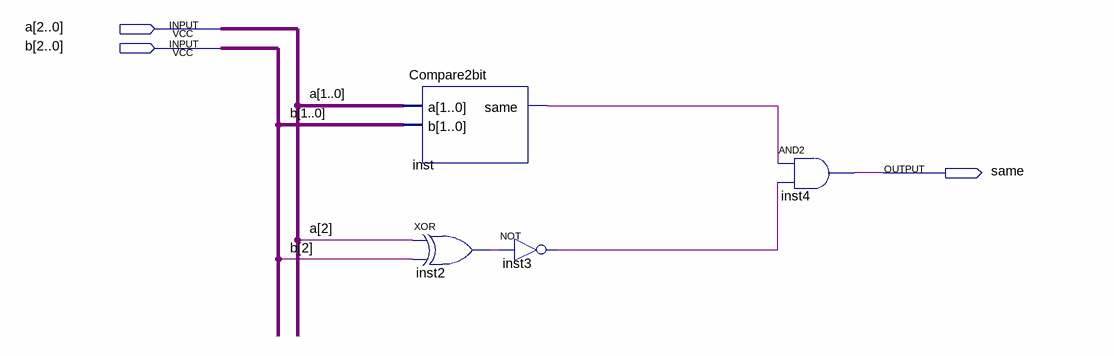
[diagram p0: schematic sheet]
// Quartus schematic Compare3bit.bdf as structural Verilog: 4 symbols, 3 pins
module Compare3bit (
  input  [2:0] a,
  input  [2:0] b,
  output same
);

  wire inst2_out, inst3_out, inst_same;

  Compare2bit inst (.a(a[1:0]), .b(b[1:0]), .same(inst_same));
  xor inst2 (inst2_out, a[2], b[2]);
  not inst3 (inst3_out, inst2_out);
  and inst4 (same, inst_same, inst3_out);
endmodule
